# EAGLE board axiom_beta_power_board_v0.38_r1.2b (EAGLE 7.7.0), part 1 of 3
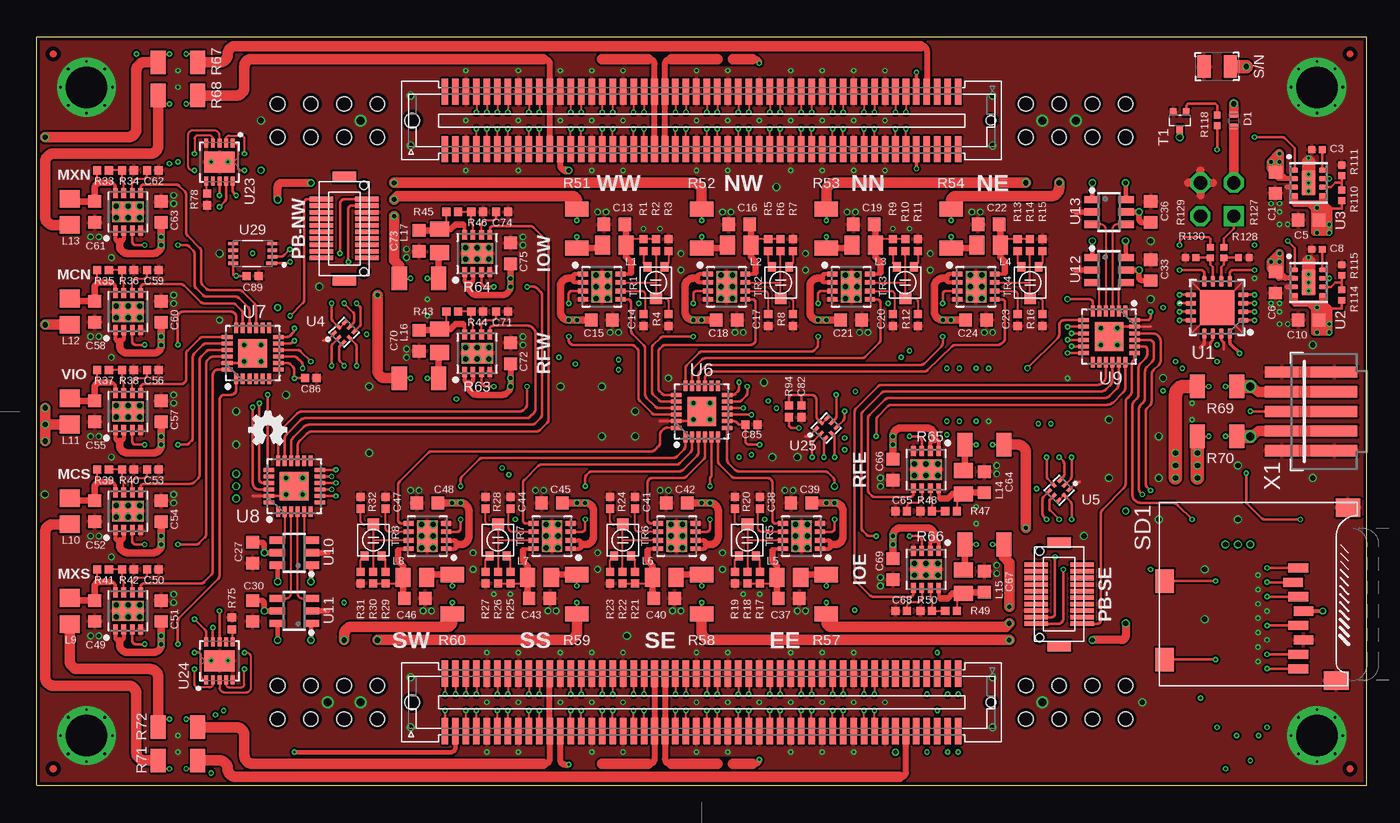
[diagram p10: board, top side]
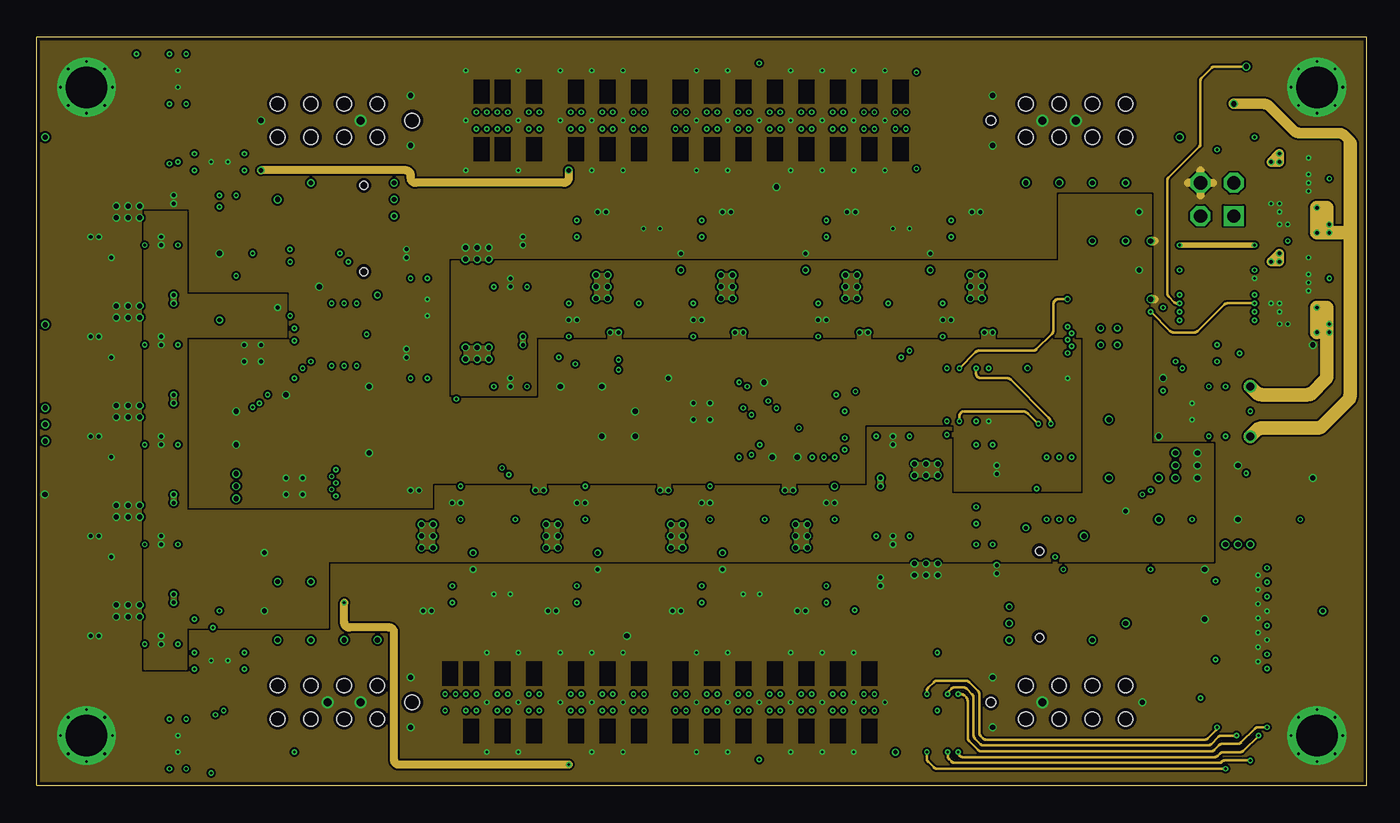
[diagram p11: board, inner layer Route2]
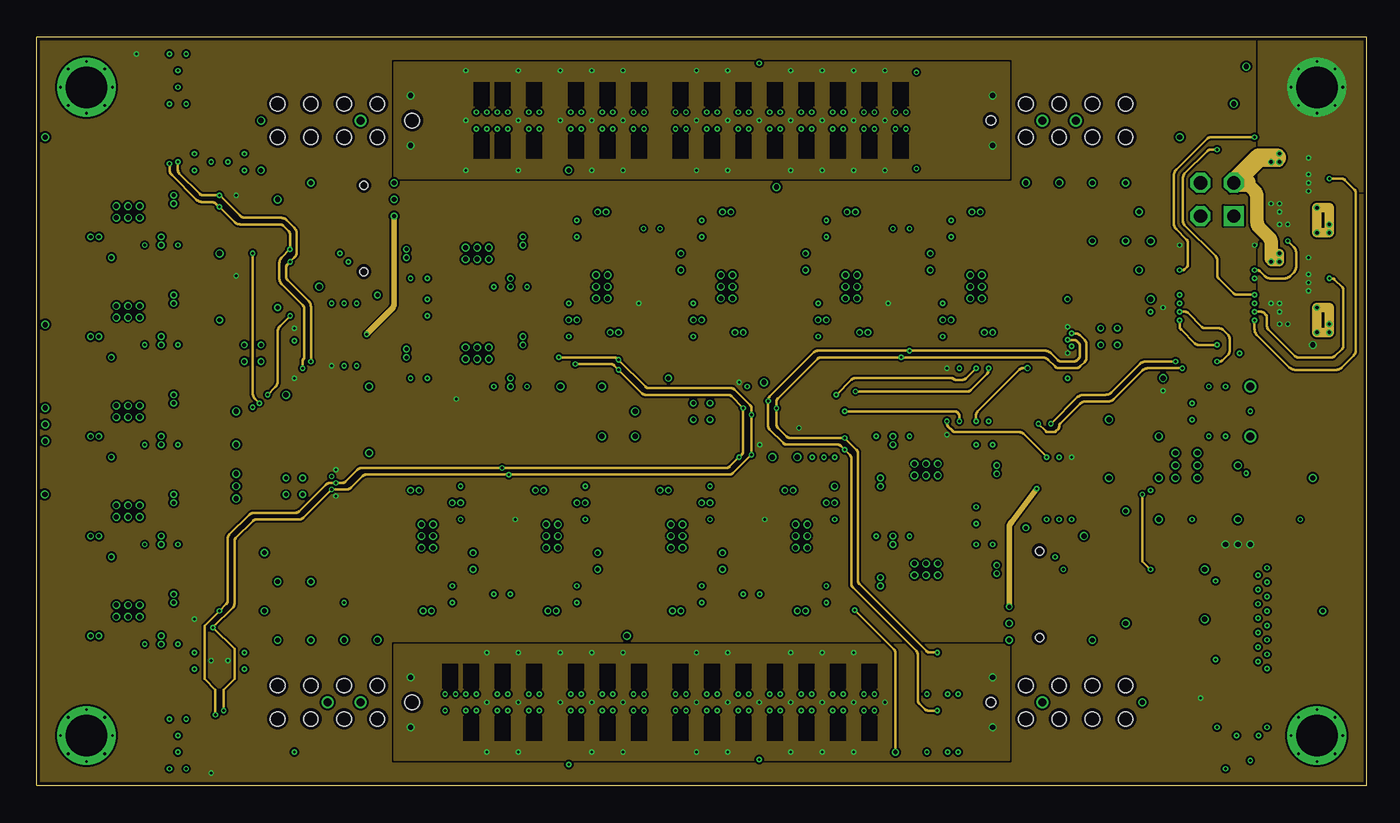
[diagram p12: board, inner layer Route15]
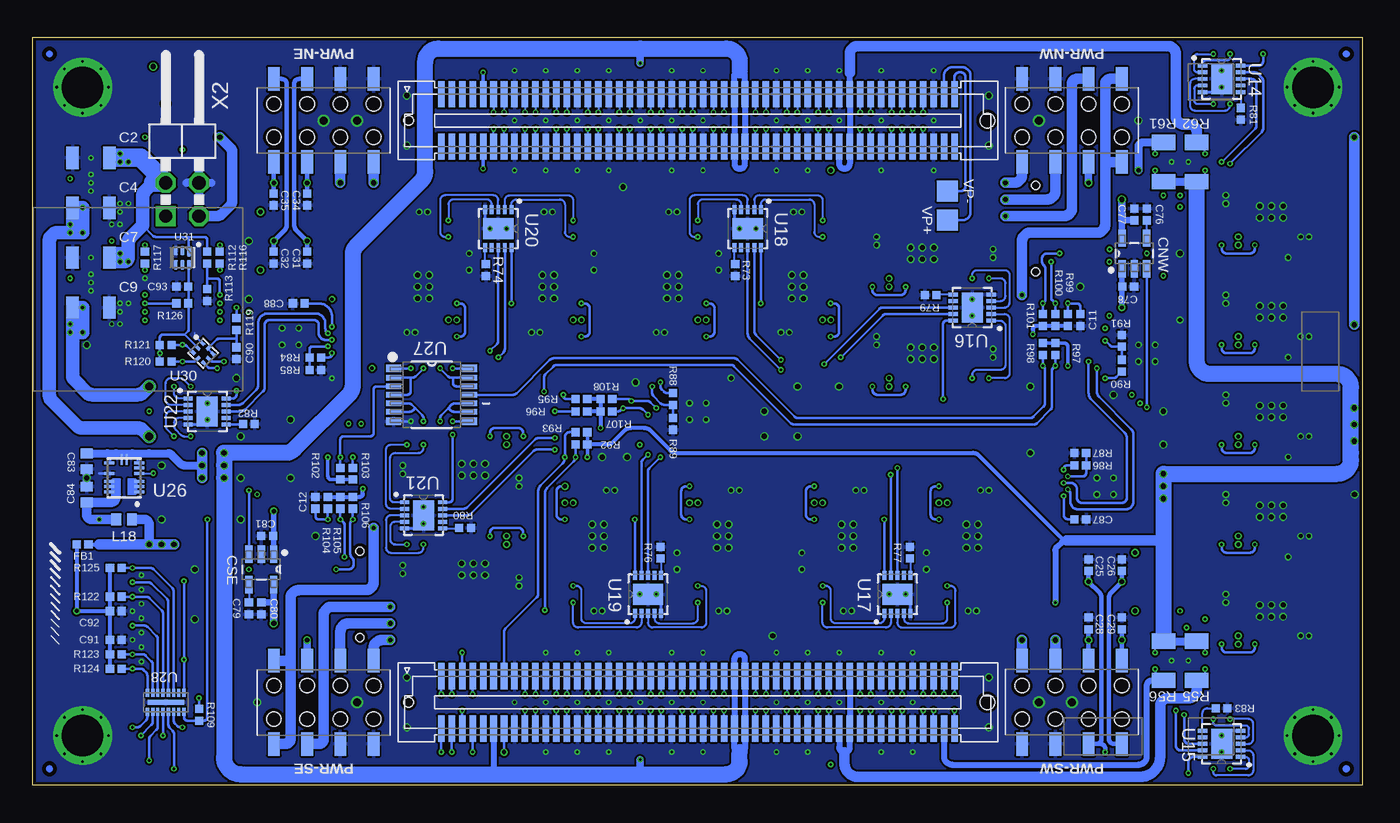
[diagram p13: board, bottom side, seen from below]

Size 101.6 x 57.15 mm. Coordinates in mm from the lower left corner, seen from the top.
Outline: 101.6,57.15 0,57.15 0,0 101.6,0 101.6,57.15
Copper layers (1*2*15*16): Top 0.035559375mm / dielectric 0.17018125mm / Route2 0.01778125mm / dielectric 47mil / Route15 0.01778125mm / dielectric 0.17018125mm / Bottom 0.035559375mm
Design rules "OSHPark-4layer-tuned *": minimum track width 5mil, minimum drill 8mil, track to track 6mil, track to pad 5mil, pad to pad 5mil, via to via 5mil, smd to smd 0mil, copper to edge 10mil, drill to drill 6mil, minimum pad ring 4mil, minimum via ring 4mil, stop-mask expansion 2mil, vias tented up to drill 25mil, thermal gap 6mil
Net classes: 0 default: width 0.152 mm, drill 0.203 mm, clearance 0.127 mm; 1 LVDS: width 0.127 mm, drill 0.203 mm, clearance 0.127 mm; 2 power: width 0.254 mm, drill 0.254 mm, clearance 0.127 mm
tKeepout: area 1.3,50.8 to 6.3,55.9; area 1.3,1.3 to 6.3,6.3; area 95.2,1.3 to 100.3,6.3; area 95.2,50.8 to 100.3,55.9
bKeepout: area 95.2,50.8 to 100.3,55.9; area 95.2,1.3 to 100.3,6.3; area 1.3,1.3 to 6.3,6.3; area 1.3,50.8 to 6.3,55.9

## Footprints (pad centres in the part's own frame; a part is rotated, then mirrored left to right if it is on the bottom)
µZ-SOCKET-NOHOLES-R = smd 0.5 x 2: 1 19.6,24.425; 2 19.6,20.027; 3 18.8,24.425; 4 18.8,20.027; 5 18,24.425; 6 18,20.027; 7 17.2,24.425; 8 17.2,20.027; 9 16.4,24.425; 10 16.4,20.027; 11 15.6,24.425; 12 15.6,20.027; 13 14.8,24.425; 14 14.8,20.027; 15 14,24.425; 16 14,20.027; 17 13.2,24.425; 18 13.2,20.027; 19 12.4,24.425; 20 12.4,20.027; 21 11.6,24.425; 22 11.6,20.027; 23 10.8,24.425; 24 10.8,20.027; 25 10,24.425; 26 10,20.027; 27 9.2,24.425; 28 9.2,20.027; 29 8.4,24.425; 30 8.4,20.027; 31 7.6,24.425; 32 7.6,20.027; 33 6.8,24.425; 34 6.8,20.027; 35 6,24.425; 36 6,20.027; 37 5.2,24.425; 38 5.2,20.027; 39 4.4,24.425; 40 4.4,20.027; 41 3.6,24.425; 42 3.6,20.027; 43 2.8,24.425; 44 2.8,20.027; 45 2,24.425; 46 2,20.027; 47 1.2,24.425; 48 1.2,20.027; 49 0.4,24.425; 50 0.4,20.027; 51 -0.4,24.425; 52 -0.4,20.027; 53 -1.2,24.425; 54 -1.2,20.027; 55 -2,24.425; 56 -2,20.027; 57 -2.8,24.425; 58 -2.8,20.027; 59 -3.6,24.425; 60 -3.6,20.027; 61 -4.4,24.425; 62 -4.4,20.027; 63 -5.2,24.425; 64 -5.2,20.027; 65 -6,24.425; 66 -6,20.027; 67 -6.8,24.425; 68 -6.8,20.027; 69 -7.6,24.425; 70 -7.6,20.027; 71 -8.4,24.425; 72 -8.4,20.027; 73 -9.2,24.425; 74 -9.2,20.027; 75 -10,24.425; 76 -10,20.027; 77 -10.8,24.425; 78 -10.8,20.027; 79 -11.6,24.425; 80 -11.6,20.027; 81 -12.4,24.425; 82 -12.4,20.027; 83 -13.2,24.425; 84 -13.2,20.027; 85 -14,24.425; 86 -14,20.027; 87 -14.8,24.425; 88 -14.8,20.027; 89 -15.6,24.425; 90 -15.6,20.027; 91 -16.4,24.425; 92 -16.4,20.027; 93 -17.2,24.425; 94 -17.2,20.027; 95 -18,24.425; 96 -18,20.027; 97 -18.8,24.425; 98 -18.8,20.027; 99 -19.6,24.425; 100 -19.6,20.027; 101 19.6,-20.025; 102 19.6,-24.425; 103 18.8,-20.027; 104 18.8,-24.425; 105 18,-20.027; 106 18,-24.425; 107 17.2,-20.027; 108 17.2,-24.425; 109 16.4,-20.027; 110 16.4,-24.425; 111 15.6,-20.027; 112 15.6,-24.425; 113 14.8,-20.027; 114 14.8,-24.425; 115 14,-20.027; 116 14,-24.425; 117 13.2,-20.027; 118 13.2,-24.425; 119 12.4,-20.027; 120 12.4,-24.425; 121 11.6,-20.027; 122 11.6,-24.425; 123 10.8,-20.027; 124 10.8,-24.425; 125 10,-20.027; 126 10,-24.425; 127 9.2,-20.027; 128 9.2,-24.425; 129 8.4,-20.027; 130 8.4,-24.425; 131 7.6,-20.027; 132 7.6,-24.425; 133 6.8,-20.027; 134 6.8,-24.425; 135 6,-20.027; 136 6,-24.425; 137 5.2,-20.027; 138 5.2,-24.425; 139 4.4,-20.027; 140 4.4,-24.425; 141 3.6,-20.027; 142 3.6,-24.425; 143 2.8,-20.027; 144 2.8,-24.425; 145 2,-20.027; 146 2,-24.425; 147 1.2,-20.027; 148 1.2,-24.425; 149 0.4,-20.027; 150 0.4,-24.425; 151 -0.4,-20.027; 152 -0.4,-24.425; 153 -1.2,-20.027; 154 -1.2,-24.425; 155 -2,-20.027; 156 -2,-24.425; 157 -2.8,-20.027; 158 -2.8,-24.425; 159 -3.6,-20.027; 160 -3.6,-24.425; 161 -4.4,-20.027; 162 -4.4,-24.425; 163 -5.2,-20.027; 164 -5.2,-24.425; 165 -6,-20.027; 166 -6,-24.425; 167 -6.8,-20.027; 168 -6.8,-24.425; 169 -7.6,-20.027; 170 -7.6,-24.425; 171 -8.4,-20.027; 172 -8.4,-24.425; 173 -9.2,-20.027; 174 -9.2,-24.425; 175 -10,-20.027; 176 -10,-24.425; 177 -10.8,-20.027; 178 -10.8,-24.425; 179 -11.6,-20.027; 180 -11.6,-24.425; 181 -12.4,-20.027; 182 -12.4,-24.425; 183 -13.2,-20.027; 184 -13.2,-24.425; 185 -14,-20.027; 186 -14,-24.425; 187 -14.8,-20.027; 188 -14.8,-24.425; 189 -15.6,-20.027; 190 -15.6,-24.425; 191 -16.4,-20.027; 192 -16.4,-24.425; 193 -17.2,-20.027; 194 -17.2,-24.425; 195 -18,-20.027; 196 -18,-24.425; 197 -18.8,-20.027; 198 -18.8,-24.425; 199 -19.6,-20.027; 200 -19.6,-24.425 | hole 0.725: 22.1,22.225; 22.1,-22.225 | hole 1.125: -22.1,22.225; -22.1,-22.225
0603-B = smd 0.95 x 1: 1 -0.8,0; 2 0.8,0
1206-C = smd 0.95 x 1.7: 1 -1.4,0; 2 1.4,0
0402-C = smd 0.52 x 0.52: 1 -0.4,0; 2 0.4,0
0402-B = smd 0.62 x 0.62: 1 -0.45,0; 2 0.45,0
0603-C = smd 0.75 x 0.9: 1 -0.6,0; 2 0.6,0
SOT95P280X145-5N = smd 1.321 x 0.559: 1 -1.168,0.94; 2 -1.168,0; 3 -1.168,-0.94; 4 1.168,-0.94; 5 1.168,0.94
DFN1006D-2 = smd 0.5 x 0.7: A 0.45,0; C -0.45,0
DFN65P300X300X100-9N = smd 0.762 x 0.356: 1 -1.422,0.965; 2 -1.422,0.33; 3 -1.422,-0.33; 4 -1.422,-0.965; 5 1.422,-0.965; 6 1.422,-0.33; 7 1.422,0.33; 8 1.422,0.965 | smd 1.549 x 2.413: 9 0,0
0805-B = smd 1.15 x 1.45: 1 -0.9,0; 2 0.9,0
0805-A = smd 1.35 x 1.55: 1 -1,0; 2 1,0
DF12(XX)-20DP-0.5V = smd 1.8 x 0.35: 1 -1.75,2.25; 2 1.75,2.25; 3 -1.75,1.75; 4 1.75,1.75; 5 -1.75,1.25; 6 1.75,1.25; 7 -1.75,0.75; 8 1.75,0.75; 9 -1.75,0.25; 10 1.75,0.25; 11 -1.75,-0.25; 12 1.75,-0.25; 13 -1.75,-0.75; 14 1.75,-0.75; 15 -1.75,-1.25; 16 1.75,-1.25; 17 -1.75,-1.75; 18 1.75,-1.75; 19 -1.75,-2.25; 20 1.75,-2.25 | smd 1.8 x 0.8: M1 0,3.95; M2 0,-3.95 | hole 0.625: 1.5,-3.3; 1.5,3.3
R2X04 = smd 0.9 x 1.8: 1 -3.81,3.175; 2 -3.81,-3.175; 3 -1.27,3.175; 4 -1.27,-3.175; 5 1.27,3.175; 6 1.27,-3.175; 7 3.81,3.175; 8 3.81,-3.175 | hole 1.1: -3.81,1.27; -1.27,1.27; -1.27,-1.27; -3.81,-1.27; 1.27,1.27; 1.27,-1.27; 3.81,1.27; 3.81,-1.27
1206-B = smd 1.15 x 1.8: 1 -1.5,0; 2 1.5,0
3X2MM = smd 1 x 1.75: 1 -1,0; 2 1,0
TF-MICRO-SD_PP2 = smd 0.7 x 1.5: 1 9,-10.64; 2 7.9,-10.24; 3 6.8,-10.64; 4 5.7,-11.04; 5 4.6,-10.64; 6 3.5,-11.04; 7 2.4,-10.64; 8 1.3,-10.64 | smd 1.8 x 1.4: CD1 2,-0.44; CD2 8,-0.44 | smd 1.4 x 1.9: MT1 0.4,-13.54; MT2 13.6,-14.44
SOT416 = smd 0.5 x 0.6: 1 -0.5,-0.65; 2 0.5,-0.65; 3 0,0.65
TRIM-PVZ2A = smd 0.6 x 0.7: 1 -0.65,-1.2; 3 0.65,-1.2 | smd 0.9 x 0.9: 2 0,1.2
UQFN65P400X400X100-17N = smd 0.8 x 0.35: 1 -2,0.975; 2 -2,0.325; 3 -2,-0.325; 4 -2,-0.975; 9 2,-0.975; 10 2,-0.325; 11 2,0.325; 12 2,0.975 | smd 0.35 x 0.8: 5 -0.975,-2; 6 -0.325,-2; 7 0.325,-2; 8 0.975,-2; 13 0.975,2; 14 0.325,2; 15 -0.325,2; 16 -0.975,2 | smd 2.7 x 2.7: EP 0,0
SIL0008D-GM = smd 0.5 x 0.4: 1 -1.05,0.975; 2 -1.05,0.325; 3 -1.05,-0.325; 4 -1.05,-0.975; 5 1.05,-0.975; 6 1.05,-0.325; 7 1.05,0.325; 8 1.05,0.975 | smd 1.1 x 1.9: EPAD 0,0
PCA9570GMH = smd 0.45 x 0.25: 1 -0.6,0.5; 2 -0.6,0; 3 -0.6,-0.5; 5 0.6,-0.5; 6 0.6,0; 7 0.6,0.5 | smd 0.25 x 0.45: 4 0,-0.6; 8 0,0.6
QFN50P400X400X80-25N = smd 0.813 x 0.305: 1 -1.95,1.25; 2 -1.95,0.75; 3 -1.95,0.25; 4 -1.95,-0.25; 5 -1.95,-0.75; 6 -1.95,-1.25; 13 1.95,-1.25; 14 1.95,-0.75; 15 1.95,-0.25; 16 1.95,0.25; 17 1.95,0.75; 18 1.95,1.25 | smd 0.305 x 0.813: 7 -1.25,-1.95; 8 -0.75,-1.95; 9 -0.25,-1.95; 10 0.25,-1.95; 11 0.75,-1.95; 12 1.25,-1.95; 19 1.25,1.95; 20 0.75,1.95; 21 0.25,1.95; 22 -0.25,1.95; 23 -0.75,1.95; 24 -1.25,1.95 | smd 2.2 x 2.2: 25 0,0
SOT23-6 = smd 0.55 x 1.2: 1 -0.95,-1.3; 2 0,-1.3; 3 0.95,-1.3; 4 0.95,1.3; 5 0,1.3; 6 -0.95,1.3
DFN3X3_10LEAD = smd 0.7 x 0.3: 1 -1.45,1; 2 -1.45,0.5; 3 -1.45,0; 4 -1.45,-0.5; 5 -1.45,-1; 6 1.45,-1; 7 1.45,-0.5; 8 1.45,0; 9 1.45,0.5; 10 1.45,1 | smd 1.6 x 2.3: EPAD 0,0
MLPQ-13 = smd 0.8 x 0.2: 1 -1.15,1.065; 2 -1.15,0.665; 3 -1.15,0.265; 4 -1.15,-0.355; 5 -1.15,-0.755; 6 -1.15,-1.155; 9 1.15,-1.155; 10 1.15,-0.355; 11 1.15,0.265; 12 1.15,0.665; 13 1.15,1.065 | smd 0.2 x 0.8: 7 -0.2,-1.4; 8 0.2,-1.4
SOP65P640X120-14N = smd 0.6 x 1.15: 1 -2.025,-2.9; 7 2.025,-2.9; 8 2.025,2.9; 14 -2.025,2.9 | smd 0.4 x 1.15: 2 -1.3,-2.9; 3 -0.65,-2.9; 4 0,-2.9; 5 0.65,-2.9; 6 1.3,-2.9; 9 1.3,2.9; 10 0.65,2.9; 11 0,2.9; 12 -0.65,2.9; 13 -1.3,2.9
SON40P135X330X55-17N = smd 0.61 x 0.254: 1 -0.737,1.397; 2 -0.737,0.991; 3 -0.737,0.61; 4 -0.737,0.203; 5 -0.737,-0.203; 6 -0.737,-0.61; 7 -0.737,-0.991; 8 -0.737,-1.397; 9 0.737,-1.397; 10 0.737,-0.991; 11 0.737,-0.61; 12 0.737,-0.203; 13 0.737,0.203; 14 0.737,0.61; 15 0.737,0.991; 16 0.737,1.397 | smd 0.406 x 2.794: 17 0,0
SOT996-2/3 = smd 0.25 x 0.85: 1 -0.75,-1.45 | smd 0.25 x 0.75: 2 -0.25,-1.5; 3 0.25,-1.5; 4 0.75,-1.5; 5 0.75,1.5; 6 0.25,1.5; 7 -0.25,1.5; 8 -0.75,1.5
DFN150X150X50-6N = smd 0.83 x 0.33: 1 -0.49,0.5 | smd 0.73 x 0.33: 2 -0.54,0; 3 -0.54,-0.5; 4 0.54,-0.5; 5 0.54,0; 6 0.54,0.5
TP16SQ = smd 1.6 x 1.6: TP 0,0
PICO-SPOX-5 = smd 0.85 x 2.55: 1 -3,-6.5; 2 -1.5,-6.5; 3 0,-6.5; 4 1.5,-6.5; 5 3,-6.5 | smd 0.85 x 3.55: 1A -3,-2.5; 2A -1.5,-2.5; 3A 0,-2.5; 4A 1.5,-2.5; 5A 3,-2.5
2X02/90 = drill 1.016 square: 1 -1.27,-6.35 | drill 1.016 octagon: 2 -1.27,-3.81; 3 1.27,-6.35; 4 1.27,-3.81
µZ-CONONLY = smd 0.5 x 2: 1 19.6,-24.226; 2 19.6,-20.226; 3 18.8,-24.226; 4 18.8,-20.226; 5 18,-24.226; 6 18,-20.226; 7 17.2,-24.226; 8 17.2,-20.226; 9 16.4,-24.226; 10 16.4,-20.226; 11 15.6,-24.226; 12 15.6,-20.226; 13 14.8,-24.226; 14 14.8,-20.226; 15 14,-24.226; 16 14,-20.226; 17 13.2,-24.226; 18 13.2,-20.226; 19 12.4,-24.226; 20 12.4,-20.226; 21 11.6,-24.226; 22 11.6,-20.226; 23 10.8,-24.226; 24 10.8,-20.226; 25 10,-24.226; 26 10,-20.226; 27 9.2,-24.226; 28 9.2,-20.226; 29 8.4,-24.226; 30 8.4,-20.226; 31 7.6,-24.226; 32 7.6,-20.226; 33 6.8,-24.226; 34 6.8,-20.226; 35 6,-24.226; 36 6,-20.226; 37 5.2,-24.226; 38 5.2,-20.226; 39 4.4,-24.226; 40 4.4,-20.226; 41 3.6,-24.226; 42 3.6,-20.226; 43 2.8,-24.226; 44 2.8,-20.226; 45 2,-24.226; 46 2,-20.226; 47 1.2,-24.226; 48 1.2,-20.226; 49 0.4,-24.226; 50 0.4,-20.226; 51 -0.4,-24.226; 52 -0.4,-20.226; 53 -1.2,-24.226; 54 -1.2,-20.226; 55 -2,-24.226; 56 -2,-20.226; 57 -2.8,-24.226; 58 -2.8,-20.226; 59 -3.6,-24.226; 60 -3.6,-20.226; 61 -4.4,-24.226; 62 -4.4,-20.226; 63 -5.2,-24.226; 64 -5.2,-20.226; 65 -6,-24.226; 66 -6,-20.226; 67 -6.8,-24.226; 68 -6.8,-20.226; 69 -7.6,-24.226; 70 -7.6,-20.226; 71 -8.4,-24.226; 72 -8.4,-20.226; 73 -9.2,-24.226; 74 -9.2,-20.226; 75 -10,-24.226; 76 -10,-20.226; 77 -10.8,-24.226; 78 -10.8,-20.226; 79 -11.6,-24.226; 80 -11.6,-20.226; 81 -12.4,-24.226; 82 -12.4,-20.226; 83 -13.2,-24.226; 84 -13.2,-20.226; 85 -14,-24.226; 86 -14,-20.226; 87 -14.8,-24.226; 88 -14.8,-20.226; 89 -15.6,-24.226; 90 -15.6,-20.226; 91 -16.4,-24.226; 92 -16.4,-20.226; 93 -17.2,-24.226; 94 -17.2,-20.226; 95 -18,-24.226; 96 -18,-20.226; 97 -18.8,-24.226; 98 -18.8,-20.226; 99 -19.6,-24.226; 100 -19.6,-20.226; 101 19.6,20.226; 102 19.6,24.226; 103 18.8,20.226; 104 18.8,24.226; 105 18,20.226; 106 18,24.226; 107 17.2,20.226; 108 17.2,24.226; 109 16.4,20.226; 110 16.4,24.226; 111 15.6,20.226; 112 15.6,24.226; 113 14.8,20.226; 114 14.8,24.226; 115 14,20.226; 116 14,24.226; 117 13.2,20.226; 118 13.2,24.226; 119 12.4,20.226; 120 12.4,24.226; 121 11.6,20.226; 122 11.6,24.226; 123 10.8,20.226; 124 10.8,24.226; 125 10,20.226; 126 10,24.226; 127 9.2,20.226; 128 9.2,24.226; 129 8.4,20.226; 130 8.4,24.226; 131 7.6,20.226; 132 7.6,24.226; 133 6.8,20.226; 134 6.8,24.226; 135 6,20.226; 136 6,24.226; 137 5.2,20.226; 138 5.2,24.226; 139 4.4,20.226; 140 4.4,24.226; 141 3.6,20.226; 142 3.6,24.226; 143 2.8,20.226; 144 2.8,24.226; 145 2,20.226; 146 2,24.226; 147 1.2,20.226; 148 1.2,24.226; 149 0.4,20.226; 150 0.4,24.226; 151 -0.4,20.226; 152 -0.4,24.226; 153 -1.2,20.226; 154 -1.2,24.226; 155 -2,20.226; 156 -2,24.226; 157 -2.8,20.226; 158 -2.8,24.226; 159 -3.6,20.226; 160 -3.6,24.226; 161 -4.4,20.226; 162 -4.4,24.226; 163 -5.2,20.226; 164 -5.2,24.226; 165 -6,20.226; 166 -6,24.226; 167 -6.8,20.226; 168 -6.8,24.226; 169 -7.6,20.226; 170 -7.6,24.226; 171 -8.4,20.226; 172 -8.4,24.226; 173 -9.2,20.226; 174 -9.2,24.226; 175 -10,20.226; 176 -10,24.226; 177 -10.8,20.226; 178 -10.8,24.226; 179 -11.6,20.226; 180 -11.6,24.226; 181 -12.4,20.226; 182 -12.4,24.226; 183 -13.2,20.226; 184 -13.2,24.226; 185 -14,20.226; 186 -14,24.226; 187 -14.8,20.226; 188 -14.8,24.226; 189 -15.6,20.226; 190 -15.6,24.226; 191 -16.4,20.226; 192 -16.4,24.226; 193 -17.2,20.226; 194 -17.2,24.226; 195 -18,20.226; 196 -18,24.226; 197 -18.8,20.226; 198 -18.8,24.226; 199 -19.6,20.226; 200 -19.6,24.226 | hole 1.125: -22.1,-22.225; -22.1,22.225 | hole 0.725: 22.1,-22.225; 22.1,22.225

## Placement (x,y rotation side)
BETA  µZ-FCI-SOCKET-NOHOLES-R  [µZ-SOCKET-NOHOLES-R]  50.8,28.57 0 top
C1  10u  [0603-B]  94.61,46.04 270 top
C2  10u  [1206-C]  97.16,47.94 180 bottom
C3  1n  [0402-C]  97.79,48.58 180 top
C4  10u  [1206-C]  97.16,44.13 0 bottom
C5  10u  [0603-B]  97.16,43.18 180 top
C6  10u  [0603-B]  94.61,38.42 270 top
C7  10u  [1206-C]  97.16,40.32 180 bottom
C8  1n  [0402-C]  97.79,40.96 180 top
C9  10u  [1206-C]  97.16,36.51 0 bottom
C10  10u  [0603-B]  97.16,35.56 180 top
C11  10n  [0402-B]  21.59,35.56 270 bottom
C12  10n  [0402-B]  80.01,21.59 90 bottom
C13  4u7  [0603-B]  44.13,42.86 180 top
C14  DNP  [0402-B]  46.35,35.56 270 top  (not fitted)
C15  10u  [0603-B]  43.18,35.56 0 top
C16  4u7  [0603-B]  53.66,42.86 180 top
C17  DNP  [0402-B]  55.88,35.56 270 top  (not fitted)
C18  10u  [0603-B]  52.7,35.56 0 top
C19  4u7  [0603-B]  63.18,42.86 180 top
C20  DNP  [0402-B]  65.41,35.56 270 top  (not fitted)
C21  10u  [0603-B]  62.23,35.56 0 top
C22  4u7  [0603-B]  72.71,42.86 180 top
C23  DNP  [0402-B]  74.93,35.56 270 top  (not fitted)
C24  10u  [0603-B]  71.75,35.56 0 top
C25  1u  [0402-B]  20.95,16.83 90 bottom
C26  1u  [0402-B]  18.41,16.83 90 bottom
C27  4u7  [0603-B]  16.51,17.78 270 top
C28  1u  [0402-B]  20.95,12.38 90 bottom
C29  1u  [0402-B]  18.41,12.38 90 bottom
C30  4u7  [0603-B]  16.51,13.33 270 top
C31  1u  [0402-B]  80.64,40.32 270 bottom
C32  1u  [0402-B]  83.19,40.32 270 bottom
C33  4u7  [0603-B]  85.09,39.37 90 top
C34  1u  [0402-B]  80.64,44.77 270 bottom
C35  1u  [0402-B]  83.19,44.77 270 bottom
C36  4u7  [0603-B]  85.09,43.81 90 top
C37  4u7  [0603-B]  57.47,14.29 0 top
C38  DNP  [0402-B]  55.24,21.59 90 top  (not fitted)
C39  10u  [0603-B]  58.42,21.59 180 top
C40  4u7  [0603-B]  47.94,14.29 0 top
C41  DNP  [0402-B]  45.72,21.59 90 top  (not fitted)
C42  10u  [0603-B]  48.89,21.59 180 top
C43  4u7  [0603-B]  38.42,14.29 0 top
C44  DNP  [0402-B]  36.19,21.59 90 top  (not fitted)
C45  10u  [0603-B]  39.37,21.59 180 top
C46  4u7  [0603-B]  28.89,14.29 0 top
C47  DNP  [0402-B]  26.67,21.59 90 top  (not fitted)
C48  10u  [0603-B]  29.84,21.59 180 top
C49  4u7  [0603-B]  4.45,13.33 270 top
C50  DNP  [0402-B]  8.89,16.51 0 top  (not fitted)
C51  10u  [0603-B]  9.52,13.33 90 top
C52  4u7  [0603-B]  4.45,20.95 270 top
C53  DNP  [0402-B]  8.89,24.13 0 top  (not fitted)
C54  10u  [0603-B]  9.52,20.95 90 top
C55  4u7  [0603-B]  4.45,28.57 270 top
C56  DNP  [0402-B]  8.89,31.75 0 top  (not fitted)
C57  10u  [0603-B]  9.52,28.57 90 top
C58  4u7  [0603-B]  4.45,36.2 270 top
C59  DNP  [0402-B]  8.89,39.37 0 top  (not fitted)
C60  10u  [0603-B]  9.52,36.2 90 top
C61  4u7  [0603-B]  4.45,43.81 270 top
C62  DNP  [0402-B]  8.89,46.99 0 top  (not fitted)
C63  10u  [0603-B]  9.52,43.81 90 top
C64  4u7  [0603-B]  72.39,23.18 90 top
C65  DNP  [0402-B]  66.04,20.95 180 top  (not fitted)
C66  10u  [0603-B]  65.41,24.13 270 top
C67  4u7  [0603-B]  72.39,15.56 90 top
C68  DNP  [0402-B]  66.04,13.33 180 top  (not fitted)
C69  10u  [0603-B]  65.41,16.51 270 top
C70  4u7  [0603-B]  29.21,33.97 270 top
C71  DNP  [0402-B]  35.56,36.2 0 top  (not fitted)
C72  10u  [0603-B]  36.19,33.02 90 top
C73  4u7  [0603-B]  29.21,41.59 270 top
C74  DNP  [0402-B]  35.56,43.81 0 top  (not fitted)
C75  10u  [0603-B]  36.19,40.64 90 top
C76  10n  [0402-B]  16.51,43.62 90 bottom
C77  1u  [0402-B]  17.46,43.62 90 bottom
C78  1u  [0402-B]  17.93,38.1 0 bottom
C79  10n  [0402-B]  85.09,13.53 270 bottom
C80  1u  [0402-B]  84.14,13.53 270 bottom
C81  1u  [0402-B]  83.69,19.05 180 bottom
C82  10n  [0402-B]  58.42,28.57 270 top
C83  10u  [0603-C]  97.47,24.77 270 bottom
C84  10u  [0603-C]  97.47,22.23 90 bottom
C85  100n  [0402-B]  54.61,27.56 0 top
C86  100n  [0402-B]  20.95,31.11 0 top
C87  100n  [0402-B]  21.59,20.32 0 bottom
C88  100n  [0402-B]  81.28,36.83 180 bottom
C89  100n  [0402-B]  16.51,38.93 0 top
C90  10n  [0402-B]  86.04,33.02 270 bottom
C91  1u  [0402-B]  95.25,11.12 0 bottom
C92  100n  [0402-B]  95.25,13.32 0 bottom
C93  4u7  [0402-B]  90.17,38.1 180 bottom
CNW  SPX3819M5-L-3-3  [SOT95P280X145-5N]  17.46,40.64 90 bottom
CSE  SPX3819M5-L-3-3  [SOT95P280X145-5N]  84.14,16.51 270 bottom
D1  PMEG2010BELD  [DFN1006D-2]  91.44,50.8 90 top
EE  MCP1727-ADJE/MF  [DFN65P300X300X100-9N]  58.42,19.05 180 top
FB1  [0402-B]  97.79,18.41 180 bottom
FID1  FIDUCIAL  [FID_ARROW]  1.27,55.88 0 top  (not fitted)
FID2  FIDUCIAL  [FID_ARROW]  100.33,55.88 0 top  (not fitted)
FID3  FIDUCIAL  [FID_ARROW]  100.33,1.27 0 top  (not fitted)
FID4  FIDUCIAL  [FID_ARROW]  1.27,1.27 0 top  (not fitted)
FID5  FIDUCIAL  [FID_ARROW]  1.27,55.88 0 bottom  (not fitted)
FID6  FIDUCIAL  [FID_ARROW]  100.33,55.88 0 bottom  (not fitted)
FID7  FIDUCIAL  [FID_ARROW]  100.33,1.27 0 bottom  (not fitted)
FID8  FIDUCIAL  [FID_ARROW]  1.27,1.27 0 bottom  (not fitted)
IOE  MCP1727-ADJE/MF  [DFN65P300X300X100-9N]  67.94,16.51 270 top
IOW  MCP1727-ADJE/MF  [DFN65P300X300X100-9N]  33.66,40.64 90 top
JX1B  BERGSTAK-61083F  [61083-FAKE]  50.8,50.8 180 bottom
JX1T  BERGSTAK-61082F  [61082-FAKE]  50.8,50.8 180 top
JX2B  BERGSTAK-61083F  [61083-FAKE]  50.8,6.35 180 bottom
JX2T  BERGSTAK-61082F  [61082-FAKE]  50.8,6.35 180 top
L1  [0805-B]  44.13,41.27 180 top
L2  [0805-B]  53.66,41.27 180 top
L3  [0805-B]  63.18,41.27 180 top
L4  [0805-B]  72.71,41.27 180 top
L5  [0805-B]  57.47,15.88 0 top
L6  [0805-B]  47.94,15.88 0 top
L7  [0805-B]  38.42,15.88 0 top
L8  [0805-B]  28.89,15.88 0 top
L9  [0805-A]  2.54,13.33 270 top
L10  [0805-A]  2.54,20.95 270 top
L11  [0805-A]  2.54,28.57 270 top
L12  [0805-A]  2.54,36.2 270 top
L13  [0805-A]  2.54,43.81 270 top
L14  [0805-B]  70.8,23.18 90 top
L15  [0805-B]  70.8,15.56 90 top
L16  [0805-B]  30.8,33.97 270 top
L17  [0805-B]  30.8,41.59 270 top
L18  [0603-C]  94.61,20.32 0 bottom
LOGO1  OSHW_LOGO_FILLX0100-NT  [OSHW_FILLX100_NOTEXT]  16.26,26.04 0 top
MCN  MCP1727-ADJE/MF  [DFN65P300X300X100-9N]  6.98,36.2 90 top
MCS  MCP1727-ADJE/MF  [DFN65P300X300X100-9N]  6.98,20.95 90 top
MXN  MCP1727-ADJE/MF  [DFN65P300X300X100-9N]  6.98,43.81 90 top
MXS  MCP1727-ADJE/MF  [DFN65P300X300X100-9N]  6.98,13.33 90 top
NE  MCP1727-ADJE/MF  [DFN65P300X300X100-9N]  71.75,38.1 0 top
NN  MCP1727-ADJE/MF  [DFN65P300X300X100-9N]  62.23,38.1 0 top
NW  MCP1727-ADJE/MF  [DFN65P300X300X100-9N]  52.7,38.1 0 top
PB-NW  DF12(XX)-20DP-0.5V  [DF12(XX)-20DP-0.5V]  23.49,42.55 0 top
PB-SE  DF12(XX)-20DP-0.5V  [DF12(XX)-20DP-0.5V]  78.1,14.6 180 top
PWR-NE  PINRC-2X04  [R2X04]  79.38,50.8 180 bottom
PWR-NW  PINRC-2X04  [R2X04]  22.22,50.8 0 bottom
PWR-SE  PINRC-2X04  [R2X04]  79.38,6.35 180 bottom
PWR-SW  PINRC-2X04  [R2X04]  22.22,6.35 0 bottom
R1  RA  [0402-B]  46.35,41.27 90 top  (not fitted)
R2  102k  [0402-B]  47.31,41.27 270 top
R3  RC  [0402-B]  48.26,41.27 90 top  (not fitted)
R4  20k  [0402-B]  48.26,35.56 270 top
R5  RA  [0402-B]  55.88,41.27 90 top  (not fitted)
R6  180k  [0402-B]  56.83,41.27 270 top
R7  RC  [0402-B]  57.78,41.27 90 top  (not fitted)
R8  25k5  [0402-B]  57.78,35.56 270 top
R9  RA  [0402-B]  65.41,41.27 90 top  (not fitted)
R10  102k  [0402-B]  66.36,41.27 270 top
R11  RC  [0402-B]  67.31,41.27 90 top  (not fitted)
R12  28k  [0402-B]  67.31,35.56 270 top
R13  RA  [0402-B]  74.93,41.27 90 top  (not fitted)
R14  180k  [0402-B]  75.88,41.27 270 top
R15  RC  [0402-B]  76.83,41.27 90 top  (not fitted)
R16  25k5  [0402-B]  76.83,35.56 270 top
R17  RA  [0402-B]  55.24,15.88 270 top  (not fitted)
R18  180k  [0402-B]  54.29,15.88 90 top
R19  RC  [0402-B]  53.34,15.88 270 top  (not fitted)
R20  25k5  [0402-B]  53.34,21.59 90 top
R21  RA  [0402-B]  45.72,15.88 270 top  (not fitted)
R22  147k  [0402-B]  44.77,15.88 90 top
R23  RC  [0402-B]  43.81,15.88 270 top  (not fitted)
R24  102k  [0402-B]  43.81,21.59 90 top
R25  RA  [0402-B]  36.19,15.88 270 top  (not fitted)
R26  124k  [0402-B]  35.24,15.88 90 top
R27  RC  [0402-B]  34.29,15.88 270 top  (not fitted)
R28  19k6  [0402-B]  34.29,21.59 90 top
R29  RA  [0402-B]  26.67,15.88 270 top  (not fitted)
R30  147k  [0402-B]  25.72,15.88 90 top
R31  RC  [0402-B]  24.76,15.88 270 top  (not fitted)
R32  102k  [0402-B]  24.76,21.59 90 top
R33  180k  [0402-B]  5.08,46.99 0 top
R34  25k5  [0402-B]  6.98,46.99 0 top
R35  180k  [0402-B]  5.08,39.37 0 top
R36  25k5  [0402-B]  6.98,39.37 0 top
R37  102k  [0402-B]  5.08,31.75 0 top
R38  20k  [0402-B]  6.98,31.75 0 top
R39  180k  [0402-B]  5.08,24.13 0 top
R40  25k5  [0402-B]  6.98,24.13 0 top
R41  180k  [0402-B]  5.08,16.51 0 top
R42  25k5  [0402-B]  6.98,16.51 0 top
R43  180k  [0402-B]  31.75,36.2 0 top
R44  25k5  [0402-B]  33.66,36.2 0 top
R45  180k  [0402-B]  31.75,43.81 0 top
R46  25k5  [0402-B]  33.66,43.81 0 top
R47  180k  [0402-B]  69.85,20.95 180 top
R48  25k5  [0402-B]  67.94,20.95 180 top
R49  180k  [0402-B]  69.85,13.33 180 top
R50  25k5  [0402-B]  67.94,13.33 180 top
R51  [1206-B]  41.27,42.55 90 top
R52  [1206-B]  50.8,42.55 90 top
R53  [1206-B]  60.32,42.55 90 top
R54  [1206-B]  69.85,42.55 90 top
R55  [1206-B]  12.7,9.52 270 bottom
R56  [1206-B]  15.24,9.52 270 bottom
R57  [1206-B]  60.32,14.6 270 top
R58  [1206-B]  50.8,14.6 270 top
R59  [1206-B]  41.27,14.6 270 top
R60  [1206-B]  31.75,14.6 270 top
R61  [1206-B]  15.24,47.62 90 bottom
R62  [1206-B]  12.7,47.62 90 bottom
R63  [1206-B]  29.21,31.11 180 top
R64  [1206-B]  29.21,38.73 180 top
R65  [1206-B]  72.39,26.04 0 top
R66  [1206-B]  72.39,18.41 0 top
R67  [1206-B]  10.79,55.25 0 top
R68  [1206-B]  10.79,52.7 0 top
R69  [1206-B]  90.17,30.48 180 top
R70  [1206-B]  90.17,26.67 180 top
R71  [1206-B]  10.79,1.9 0 top
R72  [1206-B]  10.79,4.45 0 top
R73  750R  [0402-B]  47.94,39.37 270 bottom
R74  1k27  [0402-B]  66.99,39.37 270 bottom
R75  430R  [0402-B]  14.92,12.38 90 top
R76  0R  [0402-B]  53.66,17.78 90 bottom
R77  100R  [0402-B]  34.61,17.78 90 bottom
R78  560R  [0402-B]  13.02,44.77 270 top
R79  5k6  [0402-B]  33.02,37.47 180 bottom
R80  9k1  [0402-B]  68.58,19.68 0 bottom
R81  2k0  [0402-B]  9.33,51.31 270 bottom
R82  1k6  [0402-B]  85.09,27.62 0 bottom
R83  2k7  [0402-B]  10.79,5.91 0 bottom
R84  22k  [0402-B]  80.01,32.7 180 bottom
R85  10k  [0402-B]  80.01,31.75 0 bottom
R86  13k  [0402-B]  21.59,24.45 0 bottom
R87  10k  [0402-B]  21.59,25.4 180 bottom
R88  13k  [0402-B]  52.7,29.53 270 bottom
R89  3k  [0402-B]  52.7,27.62 270 bottom
R90  15k  [0402-B]  18.41,32.07 90 bottom
R91  1k  [0402-B]  18.41,33.97 90 bottom
R92  4k7  [0402-B]  59.69,26.04 180 bottom
R93  4k7  [0402-B]  59.69,26.99 180 bottom
R94  200k  [0402-B]  57.47,28.57 90 top
R95  4k7  [0402-B]  59.69,29.53 180 bottom
R96  4k7  [0402-B]  59.69,28.57 180 bottom
R97  4k7  [0402-B]  23.49,33.34 270 bottom
R98  4k7  [0402-B]  24.45,33.34 270 bottom
R99  200k  [0402-B]  22.54,35.56 90 bottom
R100  4k7  [0402-B]  23.49,35.56 90 bottom
R101  4k7  [0402-B]  24.45,35.56 90 bottom
R102  4k7  [0402-B]  78.1,23.81 90 bottom
R103  4k7  [0402-B]  77.15,23.81 90 bottom
R104  200k  [0402-B]  79.06,21.59 270 bottom
R105  4k7  [0402-B]  78.1,21.59 270 bottom
R106  4k7  [0402-B]  77.15,21.59 270 bottom
R107  4k7  [0402-B]  57.78,28.57 0 bottom
R108  4k7  [0402-B]  57.78,29.53 0 bottom
R109  10k  [0402-B]  88.9,5.4 270 bottom
R110  147k  [0402-C]  99.69,45.09 90 top
R111  28k  [0402-C]  99.69,46.99 90 top
R112  180k  [0402-B]  88.27,40.32 270 bottom
R113  20k  [0402-B]  88.27,37.47 270 bottom
R114  147k  [0402-C]  99.69,37.47 90 top
R115  28k  [0402-C]  99.69,39.37 90 top
R116  100k  [0402-B]  87.31,40.32 270 bottom
R117  100k  [0402-B]  93.03,40.32 270 bottom
R118  100k  [0402-C]  90.17,50.8 270 top
R119  200k  [0402-B]  86.04,35.24 270 bottom
R120  4k7  [0402-B]  91.44,32.38 0 bottom
R121  4k7  [0402-B]  91.44,33.66 0 bottom
R122  50k  [0402-B]  95.25,14.42 0 bottom
R123  50k  [0402-B]  95.25,10.02 0 bottom
R124  50k  [0402-B]  95.25,8.92 0 bottom
R125  50k  [0402-B]  95.25,16.62 0 bottom
R126  10k  [0402-B]  90.17,36.83 180 bottom
R127  180k  [0402-C]  90.68,40.7 270 top
R128  20k  [0402-C]  92.2,40.32 0 top
R129  180k  [0402-C]  89.66,40.7 270 top
R130  20k  [0402-C]  88.14,40.32 180 top
RFE  MCP1727-ADJE/MF  [DFN65P300X300X100-9N]  67.94,24.13 270 top
RFW  MCP1727-ADJE/MF  [DFN65P300X300X100-9N]  33.66,33.02 90 top
S/N  91658  [3X2MM]  90.17,54.93 0 top
SD1  MICRO-SD-2CD  [TF-MICRO-SD_PP2]  85.72,7.62 90 top
SE  MCP1727-ADJE/MF  [DFN65P300X300X100-9N]  48.89,19.05 180 top
SS  MCP1727-ADJE/MF  [DFN65P300X300X100-9N]  39.37,19.05 180 top
SW  MCP1727-ADJE/MF  [DFN65P300X300X100-9N]  29.84,19.05 180 top
T1  NX3008NBKT  [SOT416]  87.31,50.8 180 top
TR1  PVZ2A  [TRIM-PVZ2A]  47.31,38.42 180 top  (not fitted)
TR2  PVZ2A  [TRIM-PVZ2A]  56.83,38.42 180 top  (not fitted)
TR3  PVZ2A  [TRIM-PVZ2A]  66.36,38.42 180 top  (not fitted)
TR4  PVZ2A  [TRIM-PVZ2A]  75.88,38.42 180 top  (not fitted)
TR5  PVZ2A  [TRIM-PVZ2A]  54.29,18.73 0 top  (not fitted)
TR6  PVZ2A  [TRIM-PVZ2A]  44.77,18.73 0 top  (not fitted)
TR7  PVZ2A  [TRIM-PVZ2A]  35.24,18.73 0 top  (not fitted)
TR8  PVZ2A  [TRIM-PVZ2A]  25.72,18.73 0 top  (not fitted)
U1  PIC16F15325-JQ  [UQFN65P400X400X100-17N]  90.17,36.51 180 top
U2  TPS82130SIL-GM  [SIL0008D-GM]  97.16,38.42 0 top
U3  TPS82130SIL-GM  [SIL0008D-GM]  97.16,46.04 0 top
U4  PCA9306GM  [PCA9570GMH]  23.49,34.61 45 top
U5  PCA9306GM  [PCA9570GMH]  78.1,22.54 225 top
U6  MCP23018-E/MJ  [QFN50P400X400X80-25N]  50.8,28.57 90 top
U7  MCP23018-E/MJ  [QFN50P400X400X80-25N]  16.51,33.02 90 top
U8  MCP23018-E/MJ  [QFN50P400X400X80-25N]  19.68,22.86 90 top
U9  MCP23018-E/MJ  [QFN50P400X400X80-25N]  81.91,34.29 270 top
U10  AP7312-3333W6-7  [SOT23-6]  19.68,17.78 90 top
U11  AP7312-3333W6-7  [SOT23-6]  19.68,13.33 90 top
U12  AP7312-3333W6-7  [SOT23-6]  81.91,39.37 270 top
U13  AP7312-3333W6-7  [SOT23-6]  81.91,43.81 270 top
U14  PAC1720  [DFN3X3_10LEAD]  10.79,53.97 0 bottom
U15  PAC1720  [DFN3X3_10LEAD]  10.79,3.18 180 bottom
U16  PAC1720  [DFN3X3_10LEAD]  29.84,36.51 180 bottom
U17  PAC1720  [DFN3X3_10LEAD]  35.56,14.6 90 bottom
U18  PAC1720  [DFN3X3_10LEAD]  46.99,42.55 270 bottom
U19  PAC1720  [DFN3X3_10LEAD]  54.61,14.6 90 bottom
U20  PAC1720  [DFN3X3_10LEAD]  66.04,42.55 270 bottom
U21  PAC1720  [DFN3X3_10LEAD]  71.75,20.64 0 bottom
U22  PAC1720  [DFN3X3_10LEAD]  88.27,28.57 0 bottom
U23  PAC1720  [DFN3X3_10LEAD]  13.97,47.62 270 top
U24  PAC1720  [DFN3X3_10LEAD]  13.97,9.52 90 top
U25  PCA9306GM  [PCA9570GMH]  60.32,27.3 45 top
U26  SC202A  [MLPQ-13]  94.61,23.49 180 bottom
U27  TS3A4751  [SOP65P640X120-14N]  71.12,29.84 270 bottom
U28  IP4251CZ16-8-TTL  [SON40P135X330X55-17N]  91.44,6.35 270 bottom
U29  LM75BGD  [SOT996-2/3]  16.51,40.64 90 top
U30  PCA9306GM  [PCA9570GMH]  88.58,33.02 315 bottom
U31  NCP715  [DFN150X150X50-6N]  90.17,40.32 270 bottom
VIO  MCP1727-ADJE/MF  [DFN65P300X300X100-9N]  6.98,28.57 90 top
VP+  TPTP16SQ  [TP16SQ]  31.75,43.18 180 bottom  (not fitted)
VP-  TPTP16SQ  [TP16SQ]  31.75,45.4 180 bottom  (not fitted)
WW  MCP1727-ADJE/MF  [DFN65P300X300X100-9N]  43.18,38.1 0 top
X1  PICO-SPOX-5  [PICO-SPOX-5]  101.6,28.57 270 top
X2  [2X02/90]  90.17,49.85 0 bottom
ZED  µZ-FCI-CONONLY  [µZ-CONONLY]  50.8,28.57 180 bottom

## Tracks (layer width: path | path; a pad name or v marks a point on that pad's centre or on a via)
!X_MCLR  (via drill 0.2)
  Top 0.203: U1.3 v93.03,36.84 | U9.24 84.84,35.54 arc90 85.09,35.79 v85.09,36.2
  Route2 0.203: v85.09,36.2 86.57,34.72 arc45 86.83,34.61 88.42,34.61 arc45 88.69,34.72 90.7,36.73 arc-45 90.97,36.84 v93.03,36.84
  Bottom 0.203: R126.2 v93.03,36.83 v93.03,36.84
A_!RST  (via drill 0.2)
  Top 0.203: PB-NW.1 20.7,44.8 arc90 20.45,44.54 20.45,37.11 arc-45 20.33,36.84 v19.37,35.88 | v17.65,29.84 17.65,24.11 U8.19
  Route15 0.203: v19.37,35.88 18.6,35.11 arc45 18.41,34.66 18.41,30.87 arc-45 18.23,30.42 v17.65,29.84
A_BUS_EN  (via drill 0.2, 0.25)
  Top 0.203: U9.6 80.66,36.89 arc90 80.41,37.15 v78.74,37.15
  Route2 0.203: v78.74,37.15 78.04,37.15 arc90 77.66,36.77 77.66,34.77 arc-45 77.55,34.5 76.38,33.32 arc-45 76.11,33.21 71.98,33.21 arc45 71.71,33.1 v70.48,31.87
  Bottom 0.203: 69.51,31.14 69.51,30.75 arc-90 69.25,30.49 U27.12 | U27.13 69.51,31.14 | v70.48,31.87 69.87,31.26 arc-45 69.6,31.14 69.51,31.14
A_SCL  (via drill 0.2)
  Top 0.203: PB-NW.2 23.56,44.8 arc90 23.18,44.41 v23.18,40.64 | U4.5 24.69,35.1 arc45 24.76,35.28 24.76,36.41 arc45 24.69,36.59 v24.45,36.83
  Bottom 0.203: v23.18,40.64 24.13,40.64 arc-90 24.51,40.26 24.51,40.04 arc-45 24.4,39.77 24.37,39.74 arc45 24.26,39.47 24.26,37.13 arc45 24.33,36.95 v24.45,36.83 R101.2
A_SCL'  (via drill 0.2)
  Top 0.203: U4.4 24.37,33.73 arc-45 24.45,33.55 v24.45,32.06
  Bottom 0.203: R98.2 v24.45,32.06 24.37,31.99 arc45 24.29,31.81 24.29,29.2 arc45 24.41,28.93 25.16,28.18 arc45 25.43,28.07 43.15,28.07 arc45 43.42,28.18 47.77,32.53 arc-45 48.04,32.64 61.77,32.64 arc-45 62.12,32.49 64.66,29.96 arc45 64.93,29.84 U27.11
A_SDA  (via drill 0.2)
  Top 0.203: PB-NW.4 24.07,44.3 arc90 23.81,44.04 v23.81,40 | U4.6 24.18,35.3 arc45 24.26,35.48 24.26,35.96 arc45 24.18,36.14 v23.49,36.83
  Bottom 0.203: 23.49,36.13 R100.2 v23.49,36.83 23.74,37.07 arc45 23.81,37.25 v23.81,40
A_SDA'  (via drill 0.2)
  Top 0.203: U4.3 23.19,33.59 arc45 23.11,33.41 23.11,32.55 arc45 23.19,32.37 v23.49,32.07
  Route15 0.203: v72.71,31.87 72.71,31.71 arc-45 72.6,31.44 71.37,30.21 arc-45 71.1,30.1 v62.55,30.1
  Bottom 0.203: R97.2 v23.49,32.07 23.67,31.89 arc-45 23.74,31.71 23.74,28.99 arc45 23.86,28.72 24.91,27.67 arc45 25.18,27.56 43.4,27.56 arc45 43.67,27.67 48.02,32.02 arc-45 48.29,32.13 61.51,32.13 arc-45 61.87,31.98 62.44,31.42 arc-45 62.55,31.15 v62.55,30.1 | U27.1 v72.71,31.87
AB_SCL  (via drill 0.2)
  Top 0.203: U25.4 60.92,26.71 arc-45 60.96,26.62 v60.96,25.08
  Bottom 0.203: ZED.113 65.6,11.71 arc45 65.49,11.98 63.1,14.37 arc-45 62.99,14.64 62.99,22.47 arc45 62.81,22.92 61.15,24.58 arc-45 60.96,25.03 v60.96,25.08 60.96,26.61 arc90 60.58,26.99 R93.2
AB_SCL'  (via drill 0.2)
  Top 0.203: v61.72,28.57 61.72,28.15 arc-45 61.61,27.88 U25.5
  Route2 0.203: v70.48,27.81 70.48,28.19 arc-90 70.87,28.57 75.3,28.57 arc-45 75.75,28.39 v76.52,27.62
  Route15 0.203: v61.72,28.57 70.1,28.57 arc-90 70.48,28.19 v70.48,27.81 | v76.52,27.62 77.08,27.06 arc45 77.26,26.99 77.68,26.99 arc45 77.86,27.06 78.03,27.23 arc45 78.1,27.41 78.1,27.45 arc-45 78.18,27.63 79.7,29.15 arc-45 80.15,29.34 81.84,29.34 arc45 82.29,29.52 84.46,31.69 arc-45 84.91,31.88 v87.51,31.88
  Bottom 0.203: U27.10 69.33,29.2 arc-45 69.6,29.08 69.85,28.83 | U27.9 69.41,28.54 arc45 69.68,28.66 69.85,28.83 | 69.85,28.83 70.37,28.31 arc-45 70.48,28.04 v70.48,27.81 | R96.2 v61.72,28.57 | U30.5 88.22,31.95 arc-45 88.04,31.88 v87.51,31.88
AB_SDA  (via drill 0.2, 0.33)
  Top 0.203: U25.3 60.14,26.41 v60.14,25.08
  Route15 0.203: v65.6,2.54 65.6,10.12 arc45 65.49,10.39 v62.48,13.4
  Bottom 0.203: ZED.114 v65.6,2.54 | v62.48,13.4 62.48,22.28 arc45 62.3,22.73 60.28,24.75 arc-45 v60.14,25.08 R92.2
AB_SDA'  (via drill 0.2)
  Top 0.203: v61.09,29.84 61.09,28.22 arc-45 60.97,27.95 U25.6
  Route2 0.203: v71.75,31.87 71.75,31.5 arc90 72.14,31.11 74.14,31.11 arc-45 74.41,31 77.28,28.13 arc-45 77.47,27.68 v77.47,27.62
  Route15 0.203: v71.75,31.87 70.98,31.1 arc-45 70.72,30.99 70.21,30.99 arc-45 70.03,31.06 arc45 69.9,31.11 62.52,31.11 arc45 62.24,31 v61.09,29.84 | v77.47,27.62 79.51,29.66 arc-45 79.96,29.84 81.65,29.84 arc45 82.1,30.03 84.27,32.2 arc-45 84.72,32.38 v87,32.38
  Bottom 0.203: U27.2 72.73,31.14 | 72.73,31.14 72.73,30.1 arc90 72.99,29.84 U27.4 | v71.75,31.87 72.37,31.26 arc45 72.64,31.14 72.73,31.14 | R95.2 60.83,29.53 arc90 61.09,29.78 v61.09,29.84 | v87,32.38 87.84,32.38 arc45 88.02,32.46 U30.6
B_!RST
  Top 0.203: PB-SE.1 81.03,12.36 arc90 81.28,12.61 81.28,20.69 arc-45 81.47,21.14 83,22.67 arc45 83.19,23.12 83.19,29.25 arc-45 83.33,29.61 83.52,29.79 arc45 83.66,30.15 83.66,32.25 arc-45 83.74,32.43 83.79,32.48 arc45 83.86,32.66 U9.19
B_BUS_EN  (via drill 0.2, 0.25)
  Top 0.203: U9.7 78.49,35.54 arc90 78.1,35.16 78.1,34.45 arc-45 77.99,34.18 v75.69,31.88
  Route15 0.203: v75.69,31.88 75.34,31.88 arc45 75.07,31.77 71.87,28.56 arc45 71.75,28.29 v71.75,27.81
  Bottom 0.203: U27.5 72.91,29.2 arc45 72.64,29.08 72.39,28.83 | U27.6 72.83,28.54 arc-45 72.56,28.66 72.39,28.83 | 72.39,28.83 71.87,28.31 arc45 71.75,28.04 v71.75,27.81
B_SCL  (via drill 0.2)
  Top 0.203: PB-SE.2 78.04,12.36 arc90 78.42,12.74 v78.42,16.51 | U5.5 76.91,22.05 arc45 76.83,21.87 76.83,20.74 arc45 76.91,20.56 v77.15,20.32
  Bottom 0.203: v78.42,16.51 77.47,16.51 arc-90 77.09,16.89 77.09,17.11 arc-45 77.2,17.38 77.23,17.41 arc45 77.34,17.68 77.34,20.02 arc45 77.27,20.2 v77.15,20.32 R106.2
B_SCL'  (via drill 0.2)
  Top 0.203: U5.4 77.23,23.42 arc-45 77.15,23.6 v77.15,25.09
  Route15 0.203: v69.53,27.82 69.53,27.66 arc45 69.64,27.39 69.94,27.1 arc45 70.2,26.99 75.09,26.99 arc-45 75.36,26.88 v77.15,25.09
  Bottom 0.203: v77.15,25.09 R103.2 | U27.8 v69.53,27.82
B_SDA  (via drill 0.2)
  Top 0.203: PB-SE.4 77.53,12.85 arc90 77.79,13.11 v77.79,17.46 | U5.6 77.42,21.86 arc45 77.34,21.67 77.34,21.19 arc45 77.42,21.01 v78.1,20.32
  Bottom 0.203: v77.79,17.46 77.79,19.9 arc-45 77.86,20.08 v78.1,20.32 R105.2
B_SDA'  (via drill 0.2)
  Top 0.203: U5.3 78.41,23.56 arc45 78.49,23.74 78.49,24.6 arc45 78.41,24.78 v78.1,25.08
  Bottom 0.203: R102.2 v78.1,25.08 78.1,26.42 arc90 77.85,26.67 75.82,26.67 arc-90 75.56,26.92 75.56,30.24 arc90 75.31,30.49 U27.3
BANK13_00_N  (via drill 0.2)
  Top 0.152: BETA.89 v35.2,51.44
  Bottom 0.152: ZED.89 v35.2,51.44
BANK13_00_P  (via drill 0.2)
  Top 0.152: BETA.87 v36,51.44
  Bottom 0.152: ZED.87 v36,51.44
BANK13_01_N  (via drill 0.2)
  Top 0.152: BETA.90 v35.2,50.16
  Bottom 0.152: ZED.90 v35.2,50.16
BANK13_01_P  (via drill 0.2)
  Top 0.152: BETA.88 v36,50.16
  Bottom 0.152: ZED.88 v36,50.16
BANK13_02_N  (via drill 0.2)
  Top 0.152: BETA.93 v33.6,51.44
  Bottom 0.152: ZED.93 v33.6,51.44
BANK13_02_P  (via drill 0.2)
  Top 0.152: BETA.91 v34.4,51.44
  Bottom 0.152: ZED.91 v34.4,51.44
BANK13_03_N  (via drill 0.2)
  Top 0.152: BETA.94 v33.6,50.16
  Bottom 0.152: ZED.94 v33.6,50.16
BANK13_03_P  (via drill 0.2)
  Top 0.152: BETA.92 v34.4,50.16
  Bottom 0.152: ZED.92 v34.4,50.16
BANK13_04_N  (via drill 0.2)
  Top 0.152: BETA.195 v32.8,6.98
  Bottom 0.152: ZED.195 v32.8,6.98
BANK13_04_P  (via drill 0.2)
  Top 0.152: BETA.193 v33.6,6.98
  Bottom 0.152: ZED.193 v33.6,6.98
BANK13_05_N  (via drill 0.2)
  Top 0.152: BETA.196 v32.8,5.71
  Bottom 0.152: ZED.196 v32.8,5.71
BANK13_05_P  (via drill 0.2)
  Top 0.152: BETA.194 v33.6,5.71
  Bottom 0.152: ZED.194 v33.6,5.71
BANK13_06_N  (via drill 0.2)
  Top 0.152: BETA.199 v31.2,6.98
  Bottom 0.152: ZED.199 v31.2,6.98
BANK13_06_P  (via drill 0.2)
  Top 0.152: BETA.197 v32,6.98
  Bottom 0.152: ZED.197 v32,6.98
BANK13_SE_0  (via drill 0.2)
  Top 0.203: BETA.200 v31.2,5.71
  Bottom 0.203: ZED.200 v31.2,5.71
BETA_5V  (via drill 0.2, 0.25, 0.41, 0.61)
  Top 0.152: 91.67,27.07 91.27,26.67 v90.81,26.67
  Top 0.203: R110.1 99.69,44.07 98.74,44.07
  Top 0.305: U3.4 96.1,44.84 | 98.2,44.84 U3.5 | 98.17,42.55 C5.1
  Top 0.406: D1.A 91.44,51.44
  Top 0.508: 96.1,44.84 96.1,44.45 97.16,44.45 | 97.16,44.45 98.2,44.45 | 98.2,44.45 98.2,44.84 | 98.2,44.45 98.36,44.45 98.74,44.07 v98.74,42.86 v98.74,42.23 v97.79,42.23 97.6,42.23 97.6,44.13 | v97.79,44.13 97.6,44.13 | 97.6,44.13 97.47,44.13 97.16,44.45
  Top 0.711: 91.44,51.44 v91.44,52.07
  Top 0.813: X1.4A X1.4 93.34,27.07 v92.71,26.67 | 91.67,27.07 R70.1 | v97.79,44.13 98.04,44.13 98.17,44.01 98.17,42.55
  Top 1.016: R70.1 v92.71,26.67
  Route2 0.813: 100.33,49.05 100.33,49.21 99.88,49.66 arc45 99.43,49.85 96.47,49.85 arc-45 96.02,50.03 94.17,51.88 arc45 93.72,52.07 v91.44,52.07
  Route2 1.016: 100.33,49.05 100.33,41.91 | 100.33,41.91 100.33,29.85 arc-45 100.14,29.4 98.23,27.49 arc-45 97.78,27.3 93.61,27.3 arc45 93.16,27.12 v92.71,26.67 | 98.56,42.23 C4.1 v97.79,44.13 v97.79,42.23 v98.74,42.23 100.01,42.23 arc-90 100.33,41.91
  Route15 0.711: v97.79,44.13 v97.79,42.23 v98.74,42.23 v98.74,42.86 98.74,44.13 v97.79,44.13
  Bottom 0.152: U22.3 91.06,28.57 arc-90 91.44,28.19 91.44,27.46 arc-45 91.33,27.19 v90.81,26.67
  Bottom 1.016: v92.71,26.67 93.16,27.12 arc-45 93.61,27.3 97.78,27.3 arc45 98.23,27.49 100.14,29.4 arc45 100.33,29.85 100.33,41.59 arc90 99.69,42.23 v98.74,42.23 | v98.74,42.23 v97.79,42.23 v97.79,44.13 C4.1 98.56,42.23 v98.74,42.23
BETA_5V'  (via drill 0.2, 0.3, 0.33, 0.36, 0.41)
  Top 0.152: R70.2 v89.53,26.67
  Top 0.305: WW.2 41.15,38.43 arc-90 40.89,38.68 40.89,38.75 40.89,38.81 arc-90 41.15,39.06 WW.1 | EE.2 60.45,18.72 arc-90 60.71,18.47 60.71,18.4 60.71,18.34 arc-90 60.45,18.09 EE.1 | NW.2 50.67,38.43 arc-90 50.42,38.68 50.42,38.75 50.42,38.81 arc-90 50.67,39.06 NW.1 | SE.2 50.93,18.72 arc-90 51.18,18.47 51.18,18.4 51.18,18.34 arc-90 50.93,18.09 SE.1 | NN.2 60.2,38.43 arc-90 59.94,38.68 59.94,38.75 59.94,38.81 arc-90 60.2,39.06 NN.1 | SS.2 41.4,18.72 arc-90 41.66,18.47 41.66,18.4 41.66,18.34 arc-90 41.4,18.09 SS.1 | NE.2 69.72,38.43 arc-90 69.47,38.68 69.47,38.75 69.47,38.81 arc-90 69.72,39.06 NE.1 | SW.2 31.88,18.72 arc-90 32.13,18.47 32.13,18.4 32.13,18.34 arc-90 31.88,18.09 SW.1 | VIO.1 6.02,26.54 arc90 6.27,26.29 6.34,26.29 6.4,26.29 arc90 6.65,26.54 VIO.2 | MXN.1 6.02,41.78 arc90 6.27,41.53 6.34,41.53 6.4,41.53 arc90 6.65,41.78 MXN.2 | RFE.2 68.28,26.16 arc-90 68.53,26.42 68.59,26.42 68.66,26.42 arc-90 68.91,26.16 RFE.1 | IOE.1 68.91,18.54 arc90 68.66,18.8 68.59,18.8 68.53,18.8 arc90 68.28,18.54 IOE.2 | IOW.1 32.69,38.61 arc90 32.94,38.35 33.01,38.35 33.07,38.35 arc90 33.32,38.61 IOW.2 | RFW.2 33.32,30.99 arc-90 33.07,30.73 33.01,30.73 32.94,30.73 arc-90 32.69,30.99 RFW.1 | MCN.1 6.02,34.16 arc90 6.27,33.91 6.34,33.91 6.4,33.91 arc90 6.65,34.16 MCN.2 | MCS.1 6.02,18.92 arc90 6.27,18.67 6.34,18.67 6.4,18.67 arc90 6.65,18.92 MCS.2 | MXS.1 6.02,11.3 arc90 6.27,11.05 6.34,11.05 6.4,11.05 arc90 6.65,11.3 MXS.2
  Top 0.406: U12.5 v84.2,39.37 84.2,38.82 arc90 84.45,38.57 C33.1 | U13.5 v84.2,43.81 84.2,43.27 arc90 84.45,43.02 C36.1 | U10.5 v17.4,17.78 17.4,18.33 arc90 17.14,18.58 C27.1 | U11.5 v17.4,13.33 17.4,13.88 arc90 17.14,14.13 C30.1
  Top 0.457: C72.1 v36.19,31.11 v36.19,30.48
  Top 0.508: C75.1 v36.19,38.73 v36.19,38.1 arc-90 35.56,37.47 33.64,37.47 arc-90 33.01,38.1 33.01,38.35 | v36.19,30.48 arc-90 35.56,29.84 33.64,29.84 arc-90 33.01,30.48 33.01,30.73
  Top 0.559: C15.1 v41.27,35.56 v40.64,35.56 arc-90 40,36.2 40,38.11 arc-90 40.64,38.75 40.89,38.75 | C39.1 v60.32,21.59 v60.96,21.59 arc-90 61.59,20.95 61.59,19.04 arc-90 60.96,18.4 60.71,18.4 | C18.1 v50.8,35.56 v50.16,35.56 arc-90 49.53,36.2 49.53,38.11 arc-90 50.16,38.75 50.42,38.75 | C42.1 v50.8,21.59 v51.43,21.59 arc-90 52.07,20.95 52.07,19.04 arc-90 51.43,18.4 51.18,18.4 | C21.1 v60.32,35.56 v59.69,35.56 arc-90 59.05,36.2 59.05,38.11 arc-90 59.69,38.75 59.94,38.75 | C45.1 v41.27,21.59 v41.91,21.59 arc-90 42.54,20.95 42.54,19.04 arc-90 41.91,18.4 41.66,18.4 | C24.1 v69.85,35.56 v69.22,35.56 arc-90 68.58,36.2 68.58,38.11 arc-90 69.22,38.75 69.47,38.75 | C48.1 v31.75,21.59 v32.38,21.59 arc-90 33.02,20.95 33.02,19.04 arc-90 32.38,18.4 32.13,18.4 | C57.1 v9.52,26.67 v9.52,26.04 arc-90 8.89,25.4 6.97,25.4 arc-90 6.34,26.04 6.34,26.29 | C63.1 v9.52,41.91 v9.52,41.27 arc-90 8.89,40.64 6.97,40.64 arc-90 6.34,41.27 6.34,41.53 | C66.1 v65.41,26.04 v65.41,26.67 arc-90 66.04,27.3 67.96,27.3 arc-90 68.59,26.67 68.59,26.42 | C69.1 v65.41,18.41 v65.41,19.05 arc-90 66.04,19.68 67.96,19.68 arc-90 68.59,19.05 68.59,18.8 | C60.1 v9.52,34.29 v9.52,33.66 arc-90 8.89,33.02 6.97,33.02 arc-90 6.34,33.66 6.34,33.91 | C54.1 v9.52,19.05 v9.52,18.41 arc-90 8.89,17.78 6.97,17.78 arc-90 6.34,18.41 6.34,18.67 | C51.1 v9.52,11.43 v9.52,10.79 arc-90 8.89,10.16 6.97,10.16 arc-90 6.34,10.79 6.34,11.05
  Top 1.016: R70.2 v88.67,23.49
  Bottom 0.152: 18.4,38.1 C78.1 | U22.4 90.42,28.07 arc-90 90.81,27.69 90.81,27.46 arc-45 90.69,27.19 90.28,26.78 arc-45 90.01,26.67 v89.53,26.67 | U26.7 94.41,25.36 93.98,25.36 | U26.8 94.81,25.36 95.25,25.36 | U26.9 95.77,25.36 95.88,25.36 | U26.6 93.47,25.36 92.71,25.36 | U26.9 95.88,24.65 95.88,25.4 | U26.9 95.63,24.65 95.63,25.4 | U26.6 93.34,24.65 93.34,25.4 | U26.6 93.6,24.65 93.6,25.4 | U26.6 U26.5
  Bottom 0.203: C78.1 18.41,38.07 | 83.2,19.05 C81.1 83.19,19.05
  Bottom 0.406: CNW.1 18.4,38.1 | 18.41,38.07 v18.41,36.51 | CSE.1 83.2,19.05 | v83.19,20.95 83.19,19.05
  Bottom 0.61: v88.67,24.45 90.01,24.45 arc45 90.28,24.56 90.98,25.25 arc-45 91.25,25.36 92.71,25.36 93.98,25.36 95.25,25.36 95.88,25.36 C83.1
  Bottom 0.813: v88.67,25.4 v88.67,24.45 v88.67,23.49
  pour Route2: 8.25,43.81 11.43,43.81 11.43,37.47 19.05,37.47 19.05,34.29 11.43,34.29 11.43,20.95 30.48,20.95 30.48,22.86 63.5,22.86 63.5,27.3 69.85,27.3 69.85,22.23 80.01,22.23 80.01,34.29 38.1,34.29 38.1,29.84 31.75,29.84 31.75,40 78.1,40 78.1,45.09 85.09,45.09 85.09,26.04 89.85,26.04 89.85,17.14 22.22,17.14 22.22,12.06 11.43,12.06 11.43,8.89 8.25,8.89
BETA_5V_EN  (via drill 0.2)
  Top 0.203: U3.1 96.1,48.67 95.32,49.46 arc45 95.14,49.53 v93.03,49.53 | U1.8 89.19,39.12 arc90 88.94,39.37 v87.31,39.37
  Route15 0.203: v87.31,39.37 87.53,39.37 arc45 87.7,39.44 87.87,39.61 arc45 87.95,39.79 87.95,41.44 arc45 87.84,41.7 87.05,42.49 arc-45 86.87,42.94 86.87,46.6 arc-45 87.05,47.05 89.42,49.42 arc-45 89.69,49.53 v93.03,49.53
  Bottom 0.203: R116.2 v87.31,39.37
BETA_5V_PG  (via drill 0.2)
  Top 0.203: U3.7 v98.74,46.36 | U1.1 v93.03,35.54
  Route15 0.203: v98.74,46.36 99.66,46.36 arc-45 99.93,46.24 100.66,45.51 arc-45 100.77,45.25 100.77,33.28 arc-45 100.59,32.83 99.69,31.94 arc-45 99.24,31.75 96.15,31.75 arc-45 95.7,31.94 93.21,34.42 arc-45 93.03,34.87 v93.03,35.54
BTN
  Top 0.203: R127.1 90.68,41.78 91.44,42.55 X2.1
BTN_SENSE
  Top 0.203: U1.6 90.5,39.6 90.68,39.78 R127.2 90.7,40.32 R128.1
CD  (via drill 0.2)
  Top 0.203: SD1.CD1 v90.04,9.62 | SD1.CD2 v90.04,15.62
  Bottom 0.203: U28.1 v90.04,9.62 v90.04,15.62
CD'  (via drill 0.2)
  Top 0.203: U9.20 84.58,33.54 arc-90 84.84,33.29 84.84,32.98 arc-45 84.69,32.62 84.31,32.24 arc45 84.16,31.88 84.16,29.89 arc-45 84.02,29.53 83.84,29.36 arc45 83.69,29 83.69,22.23 arc90 84.33,21.59 86.73,21.59 arc-45 87.18,21.4 v88.27,20.32
  Bottom 0.203: U28.16 90.04,5.21 arc-90 89.79,4.95 arc-45 89.78,4.95 R109.2 88.52,4.95 arc-90 88.27,5.2 v88.27,20.32
CLK  (via drill 0.2)
  Top 0.203: SD1.5 v93.98,12.22
  Bottom 0.203: v93.98,12.22 93.1,12.22 arc45 92.83,12.11 92.16,11.44 arc45 92.05,11.17 U28.6
CMD  (via drill 0.2)
  Top 0.203: SD1.3 v93.98,14.42
  Bottom 0.203: U28.5 91.64,13.12 arc-45 91.75,13.39 92.67,14.31 arc-45 92.94,14.42 v93.98,14.42 R122.2
CNW_BYP
  Bottom 0.152: CNW.4 16.52,43.18 C76.1
CNW_EN  (via drill 0.2)
  Top 0.203: U8.22 17.02,22.61 arc-90 16.51,23.12 v16.51,28.89
  Bottom 0.203: CNW.3 16.52,30.23 arc45 16.51,30.2 v16.51,28.89
CNW_PG  (via drill 0.2)
  Top 0.203: U8.21 17.27,23.11 arc-90 17.02,23.36 v17.02,29.21
  Route15 0.203: v16.51,40.64 16.51,29.98 arc45 16.7,29.53 v17.02,29.21
CSE_BYP
  Bottom 0.152: CSE.4 85.08,13.97 C79.1
CSE_EN  (via drill 0.2)
  Top 0.203: v85.08,22.54 84.82,22.8 arc-45 84.71,23.07 84.71,28.49 arc-45 84.86,28.85 85.02,29.01 arc45 85.16,29.37 85.16,31.36 arc-45 85.31,31.72 85.71,32.12 arc45 85.86,32.48 85.86,33.91 arc90 85.22,34.54 U9.22
  Bottom 0.203: CSE.3 v85.08,22.54
CSE_PG  (via drill 0.2)
  Top 0.203: U9.21 84.96,34.04 arc-90 85.34,33.66 85.34,32.72 arc-45 85.19,32.36 84.81,31.98 arc45 84.66,31.62 84.66,29.63 arc-45 84.52,29.27 84.35,29.11 arc45 84.2,28.75 84.2,22.64 arc45 84.31,22.37 v84.45,22.23
  Route15 0.203: v85.08,16.51 84.45,17.13 v84.45,22.23
CSO_N_V'  (via drill 0.2, 0.41)
  Top 0.152: R67.1 9.29,55.88 v10.16,55.88
  Top 0.813: L12.2 v0.66,35.2 | v0.66,49.53 6.98,49.53 arc90 7.62,50.16 7.62,54.61 arc-90 8.25,55.25 R67.1
  Bottom 0.152: v10.16,55.88 10.16,55.63 arc90 10.41,55.37 11.99,55.37 arc-90 12.24,55.12 U14.1
  Bottom 0.813: v0.66,35.2 v0.66,49.53
CSO_NE_V  (via drill 0.2)
  Top 0.152: v11.43,55.88 12.29,55.88 R67.2
  Top 0.457: 67.49,56.49 67.62,56.52 arc-90 68,56.13 BETA.7
  Top 0.813: R67.2 13.97,55.25 arc90 14.6,55.88 arc-90 15.21,56.49 67.49,56.49
  Bottom 0.152: U14.2 12.64,54.47 arc90 12.89,54.73 12.89,55.63 arc90 12.64,55.88 v11.43,55.88
CSO_NW_V  (via drill 0.36, 0.41)
  Top 0.61: v18.41,44.77 18.41,45.72 arc-90 18.73,46.04 v20.95,46.04
  Bottom 0.305: CNW.5 18.41,41.81
  Bottom 0.508: 18.41,41.81 18.41,43.18 C77.1
  Bottom 0.559: v18.41,44.77 18.41,43.18 | v20.95,46.04 PWR-NW.6
CSO_S_V'  (via drill 0.2)
  Top 0.152: R71.1 9.29,1.27 v10.16,1.27
  Top 0.813: L10.2 1.29,19.95 arc90 0.66,19.32 0.66,8.25 arc90 1.29,7.62 6.98,7.62 arc-90 7.62,6.98 7.62,2.54 arc90 8.25,1.9 R71.1
  Bottom 0.152: U15.1 8.95,2.18 arc90 8.7,1.92 8.7,1.52 arc90 8.95,1.27 v10.16,1.27
CSO_SE_V  (via drill 0.36, 0.41)
  Top 0.61: v83.19,12.38 83.19,11.43 arc-90 82.87,11.11 v80.64,11.11
  Bottom 0.508: CSE.5 83.19,15.34 83.19,13.97 C80.1
  Bottom 0.559: v83.19,12.38 83.19,13.97 | v80.64,11.11 PWR-SE.6
CSO_SW_V  (via drill 0.2)
  Top 0.152: R71.2 12.29,1.27 v11.43,1.27
  Top 0.457: 65.89,0.66 66.02,0.63 arc90 66.4,1.02 BETA.112
  Top 0.813: R71.2 13.97,1.9 arc-90 14.6,1.27 arc90 15.21,0.66 65.89,0.66
  Bottom 0.152: U15.2 8.76,2.68 arc90 8.38,2.29 8.38,1.14 arc90 8.76,0.76 11.18,0.76 arc90 11.43,1.02 v11.43,1.27
CTRL  (via drill 0.2)
  Top 0.203: X1.3A 95.25,28.57 X1.3 v92.71,28.57
DAT0  (via drill 0.2)
  Top 0.203: SD1.7 v93.98,10.02
  Bottom 0.203: U28.7 92.43,9.23 arc-45 92.54,9.5 92.95,9.91 arc-45 93.22,10.02 v93.98,10.02 R123.2
DAT1  (via drill 0.2)
  Top 0.203: SD1.8 v93.98,8.92
  Bottom 0.203: U28.8 92.84,8.38 arc-45 92.95,8.65 93.11,8.81 arc-45 93.38,8.92 v93.98,8.92 R124.2
DAT2  (via drill 0.2)
  Top 0.203: SD1.1 v93.98,16.62
  Bottom 0.203: U28.3 90.83,14.81 arc-45 90.94,15.08 92.37,16.51 arc-45 92.64,16.62 v93.98,16.62 R125.2
DAT3  (via drill 0.2)
  Top 0.203: SD1.2 v93.98,15.52
  Bottom 0.203: v93.98,15.52 92.79,15.52 arc45 92.52,15.41 91.35,14.23 arc45 91.24,13.96 U28.4
E_I2C_EN
  Top 0.152: U9.5 81.16,38.17 arc90 80.91,38.42 U12.3
E_I2C_V  (via drill 0.36)
  Top 0.356: U12.1 80.64,40.35 v80.64,41.59
  Bottom 0.356: PWR-NE.6 81.25,53.97 arc-90 81.64,53.59 81.64,42.85 arc-45 81.45,42.4 v80.64,41.59 C31.1
E_SPI_EN
  Top 0.152: U9.2 82.66,38.17 arc-90 82.92,38.42 U12.4
E_SPI_V  (via drill 0.36)
  Top 0.356: U12.6 83.19,40.35 v83.19,41.59
  Bottom 0.356: PWR-NE.8 82.57,53.97 arc90 82.19,53.59 82.19,42.85 arc45 82.38,42.4 v83.19,41.59 C32.1
E_VE  (via drill 0.2, 0.36)
  Top 0.152: R57.2 v60.32,13.97
  Top 0.813: R57.2 60.32,12.51 arc90 60.71,12.13 74.04,12.13 v74.3,12.38
  Bottom 0.152: U19.2 55.11,12.45 arc90 55.49,12.06 59.94,12.06 arc90 60.32,12.45 v60.32,13.97
  Bottom 0.813: PWR-SE.4 78.1,11.75 arc90 77.47,12.38 v74.3,12.38
E_VE'  (via drill 0.2)
  Top 0.152: R57.1 v60.32,15.24
  Top 0.508: L5.2 58.6,16.1 R57.1
  Bottom 0.152: U19.1 55.61,12.76 arc90 55.99,12.38 59.31,12.38 arc90 59.69,12.76 59.69,14.86 arc-90 60.07,15.24 v60.32,15.24
EE_EN  (via drill 0.2, 0.33)
  Top 0.203: EE.3 60.71,19.38 arc90 60.96,19.63 v60.96,20.32 | U6.7 52.75,24.88 arc45 52.86,24.61 53.35,24.11 arc45 53.62,24 60.17,24 arc-45 60.44,23.89 60.85,23.48 arc-45 60.96,23.21 v60.96,22.86
  Bottom 0.203: v60.96,20.32 61.21,20.32 arc90 61.59,20.7 61.59,22.48 arc90 61.21,22.86 v60.96,22.86
EE_PG
  Top 0.203: EE.5 56.45,20.02 arc-90 56.2,20.27 56.2,23.11 arc90 55.82,23.49 53.34,23.49 arc-45 53.08,23.61 52.16,24.52 arc-45 52.05,24.79 U6.6
FAN  (via drill 0.41)
  Top 0.406: T1.3
  Top 0.508: v87.31,49.53 T1.3
  Bottom 0.813: X2.3 87.58,43.5 arc-45 87.13,43.68 86.55,44.26 arc-45 86.36,44.71 86.36,48.31 arc-45 86.55,48.76 v87.31,49.53
FAN_PWM  (via drill 0.2)
  Top 0.203: R118.2 v90.17,48.58 | U1.4 v93.03,37.49
  Route15 0.203: v93.03,37.49 91.69,37.49 arc-45 91.42,37.6 90.28,38.74 arc-45 90.17,39.01 90.17,40.16 arc45 90.06,40.43 87.68,42.81 arc-45 87.57,43.08 87.57,46.45 arc-45 87.68,46.72 89.42,48.47 arc-45 89.69,48.58 v90.17,48.58
GND  (via drill 0.2, 0.3, 0.33, 0.38, 0.41, 0.61, 3.17 pad 4.5)
  Top 0.203: 15.75,32.26 v15.88,32.38 | 50.04,27.81 v50.16,27.94 50.05,27.82 U6.23 47.62,27.82 | U7.25 v17.14,33.66 | U6.25 v51.43,29.21 | 82.68,35.05 v82.55,34.92 | 82.55,35.05 v82.55,34.92 | U9.25 v81.28,33.66 | v82.55,34.92 82.66,35.04 U9.23 85.09,35.04 | 18.92,22.1 v19.05,22.23 | 19.05,22.1 v19.05,22.23 | U8.25 v20.32,23.49 | v19.05,22.23 18.93,22.11 U8.23 16.51,22.11 | U1.EP 88.27,34.61 | U1.EP 88.27,38.42 | U1.EP 92.07,34.61 | 92.07,38.42 U1.EP | U4.1 22.15,33.97 21.91,33.97 | U5.1 79.45,23.18 79.69,23.18 | U25.1 58.98,26.67 58.74,26.67 | 89.85,34.61 89.85,34.14 arc-45 89.78,33.96 89.74,33.92 arc45 89.66,33.74 89.66,33.34 | 90.68,33.34 90.68,33.74 arc45 90.6,33.92 90.56,33.96 arc-45 90.49,34.14 90.49,34.61 | U7.23 15.76,32.27
  Top 0.254: U1.13 89.19,33.87 arc-45 89.12,33.69 88.9,33.46
  Top 0.305: 15.76,32.27 v15.88,32.38
  Top 0.381: U3.3 95.5,45.71 95.5,45.72 | U2.3 95.5,38.09 95.5,38.1
  Top 0.406: U12.2 79.38,39.37 | U13.2 79.38,43.81 | U11.2 22.22,13.33 | U10.2 22.22,17.78
  Top 0.61: X2.4 88.9,46.99 | X2.4 88.9,45.09 | X2.4 87.95,46.04 | X2.4 89.85,46.04
  Top 1.016: U2.EPAD 97.16,40 | U3.EPAD 97.16,47.62
  Route2 0.61: X2.4 88.9,46.99 | X2.4 88.9,45.09 | X2.4 87.95,46.04 | X2.4 89.85,46.04 | v85.09,37.15 85.41,37.15 | v85.09,41.59 85.41,41.59
  Bottom 0.127: U30.1 89.22,34.36 89.22,34.61